# Altium schematic sheet 但总画的.SchDoc
size D
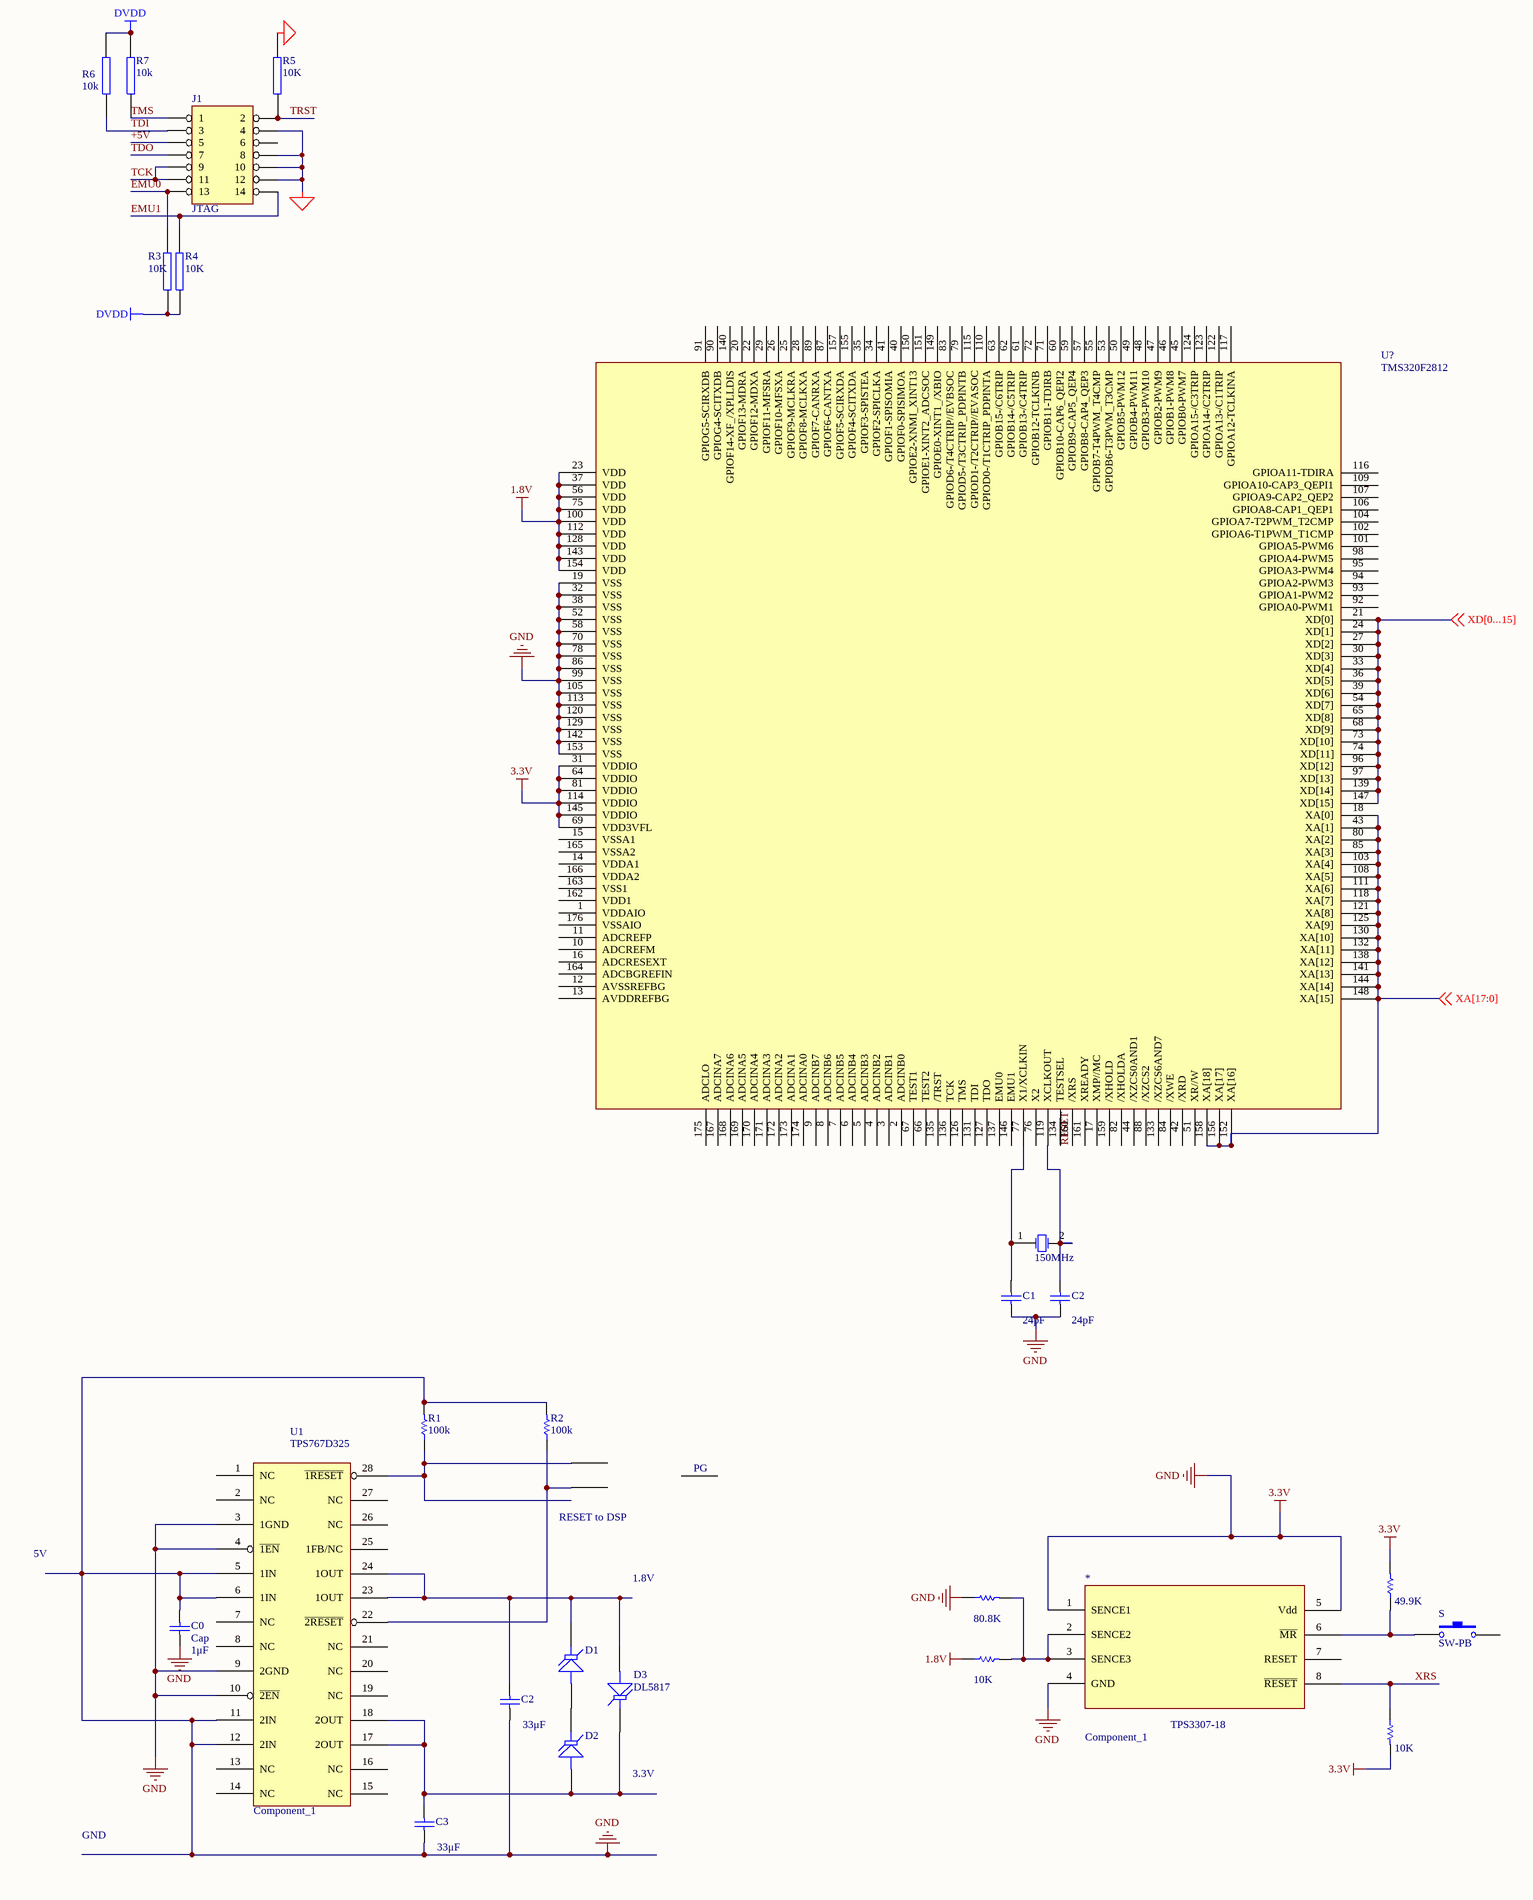
[diagram p0: 但总画的.SchDoc, bottom left]
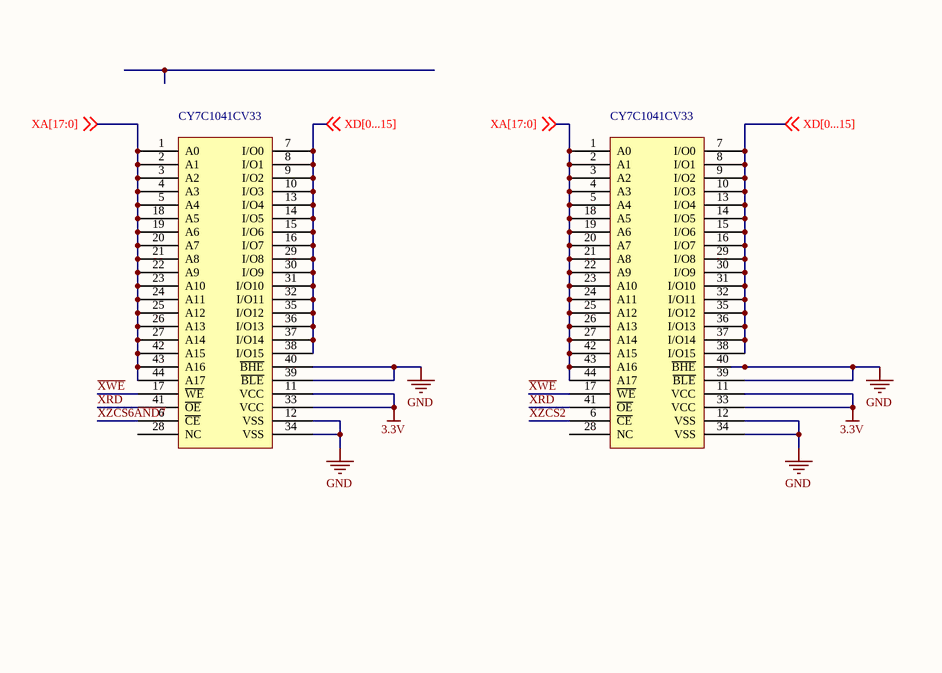
[diagram p1: 但总画的.SchDoc, bottom right]

## Parts
(Parts that share a designator on the sheet are numbered #1, #2 ... from top to bottom, then left to right.)
*#1  (no value)
*#2  Component_1
?  Component_1
C0  Cap  value 1μF  [RAD-0.3]
C1  value 24pF  [RAD-0.3]
C2#1  value 24pF  [RAD-0.3]  (hidden comment: Cap)
C2#2  value 33μF  [RAD-0.3]
C3  value 33μF  [RAD-0.3]
D1  Tranzorb  [DO-7]  (value not drawn)
D2  Tranzorb  [DO-7]  (value not drawn)
D3  DL5817  [DO-7]
J1  JTAG  [IDC-14]
R1  100k  [AXIAL-0.3]
R2  100k  [AXIAL-0.3]
R3  10K  [0805]
R4  10K  [0805]
R5  10K  [0805]
R6  10k  [0805]
R7  10k  [0805]
R?#1  value 80.8K  [AXIAL-0.3]  (hidden comment: Res1)
R?#2  value 49.9K  [AXIAL-0.3]  (hidden comment: Res1)
R?#3  value 10K  [AXIAL-0.3]  (hidden comment: Res1)
R?#4  value 10K  [AXIAL-0.3]  (hidden comment: Res1)
S  SW-PB  [SPST-2]
U?  TMS320F2812  [LQFP-176]
Y?  150MHz  [R38]
  (no value)
  (no value)

## Nets
1.8V: R?#3.1 U?.23(VDD) U?.37(VDD) U?.56(VDD) U?.75(VDD) U?.100(VDD) U?.112(VDD) U?.128(VDD) U?.143(VDD) U?.154(VDD)
3.3V: *#2.1(SENCE1) *#2.4(GND) *#2.5(Vdd) ?.3(1GND) ?.4(~{1EN}) ?.5(1IN) ?.6(1IN) ?.9(2GND) ?.10(~{2EN}) ?.11(2IN) ?.12(2IN) C0.1 C0.2 C1.1 C2#1.1 C2#2.1 C3.1 J1.4 J1.8 J1.10 J1.12 R1.2 R2.2 R5.2 R?#1.1 R?#2.2 R?#4.2 U?.19(VSS) U?.31(VDDIO) U?.32(VSS) U?.38(VSS) U?.52(VSS) U?.58(VSS) U?.64(VDDIO) U?.69(VDD3VFL) U?.70(VSS) U?.78(VSS) U?.81(VDDIO) U?.86(VSS) U?.99(VSS) U?.105(VSS) U?.113(VSS) U?.114(VDDIO) U?.120(VSS) U?.129(VSS) U?.142(VSS) U?.145(VDDIO) U?.153(VSS) .11(VCC) .12(VSS) .33(VCC) .34(VSS) .39(~{BLE}) .40(~{BHE})  [also labelled GND]
DVDD: R3.1 R4.1 R6.2 R7.2
+5V: J1.5
EMU0: J1.13 R3.2
EMU1: J1.14 R4.2
~{RESE}T: U?.160(/XRS)
TCK: J1.9 J1.11
TDI: J1.3 R6.1
TDO: J1.7
TMS: J1.1 R7.1
TRST: J1.2 R5.1
~{XRD}: .41(~{OE})
~{XWE}: .17(~{WE})
~{XZCS2}: .6(~{CE})
~{XZCS6AND7}: .6(~{CE})
XA[17:0]: U?.18(XA[0]) U?.43(XA[1]) U?.80(XA[2]) U?.85(XA[3]) U?.103(XA[4]) U?.108(XA[5]) U?.111(XA[6]) U?.118(XA[7]) U?.121(XA[8]) U?.125(XA[9]) U?.130(XA[10]) U?.132(XA[11]) U?.138(XA[12]) U?.141(XA[13]) U?.144(XA[14]) U?.148(XA[15]) U?.152(XA[16]) U?.156(XA[17]) U?.158(XA[18]) .1(A0) .2(A1) .3(A2) .4(A3) .5(A4) .18(A5) .19(A6) .20(A7) .21(A8) .22(A9) .23(A10) .24(A11) .25(A12) .26(A13) .27(A14) .42(A15) .43(A16) .44(A17) ; off-sheet XA[17:0]
XD[0...15]: U?.21(XD[0]) U?.24(XD[1]) U?.27(XD[2]) U?.30(XD[3]) U?.33(XD[4]) U?.36(XD[5]) U?.39(XD[6]) U?.54(XD[7]) U?.65(XD[8]) U?.68(XD[9]) U?.73(XD[10]) U?.74(XD[11]) U?.96(XD[12]) U?.97(XD[13]) U?.139(XD[14]) U?.147(XD[15]) .7(I/O0) .8(I/O1) .9(I/O2) .10(I/O3) .13(I/O4) .14(I/O5) .15(I/O6) .16(I/O7) .29(I/O8) .30(I/O9) .31(I/O10) .32(I/O11) .35(I/O12) .36(I/O13) .37(I/O14) .38(I/O15) ; off-sheet XD[0...15]
XRS: *#2.8(~{RESET}) R?#4.1
Net*#1_29: *#1.29 ?.28(~{1RESET}) R1.1
Net*#1_30: *#1.30 ?.22(~{2RESET}) R2.1
Net*#2_2: *#2.2(SENCE2) *#2.3(SENCE3) R?#1.2 R?#3.2
Net*#2_6: *#2.6(~{MR}) R?#2.1 S.1
Net?_17: ?.17(2OUT) ?.18(2OUT) C3.2 D2.1(A) D3.2(K)
Net?_23: ?.23(1OUT) ?.24(1OUT) C2#2.2 D1.2(K) D3.1(A)
NetC1_2: C1.2 U?.77(X1/XCLKIN) Y?.1(OSC1)
NetC2#1_2: C2#1.2 U?.119(XCLKOUT) Y?.2(OSC2)
NetD1_1: D1.1(A) D2.2(K)

Not connected (* = marked no-connect by the designer): *#1 31; *#2 7(RESET); ? 1(NC) 2(NC) 7(NC) 8(NC) 13(NC) 14(NC) 15(NC) 16(NC) 19(NC) 20(NC) 21(NC) 25(1FB/NC) 26(NC) 27(NC); J1 6; S 2; U? 1(VDDAIO) 2(ADCINB0) 3(ADCINB1) 4(ADCINB2) 5(ADCINB3) 6(ADCINB4) 7(ADCINB5) 8(ADCINB6) 9(ADCINB7) 10(ADCREFM) 11(ADCREFP) 12(AVSSREFBG) 13(AVDDREFBG) 14(VDDA1) 15(VSSA1) 16(ADCRESEXT) 17(XMP//MC) 20(GPIOF13-MDRA) 22(GPIOF12-MDXA) 25(GPIOF9-MCLKRA) 26(GPIOF10-MFSXA) 28(GPIOF8-MCLKXA) 29(GPIOF11-MFSRA) 34(GPIOF2-SPICLKA) 35(GPIOF3-SPISTEA) 40(GPIOF0-SPISIMOA) 41(GPIOF1-SPISOMIA) 42(/XRD) 44(/XZCS0AND1) 45(GPIOB0-PWM7) 46(GPIOB1-PWM8) 47(GPIOB2-PWM9) 48(GPIOB3-PWM10) 49(GPIOB4-PWM11) 50(GPIOB5-PWM12) 51(XR//W) 53(GPIOB6-T3PWM_T3CMP) 55(GPIOB7-T4PWM_T4CMP) 57(GPIOB8-CAP4_QEP3) 59(GPIOB9-CAP5_QEP4) 60(GPIOB10-CAP6_QEPI2) 61(GPIOB13-/C4TRIP) 62(GPIOB14-/C5TRIP) 63(GPIOB15-/C6TRIP) 66(TEST2) 67(TEST1) 71(GPIOB11-TDIRB) 72(GPIOB12-TCLKINB) 76(X2) 79(GPIOD5-/T3CTRIP_PDPINTB) 82(/XHOLDA) 83(GPIOD6-/T4CTRIP//EVBSOC) 84(/XWE) 87(GPIOF6-CANTXA) 88(/XZCS2) 89(GPIOF7-CANRXA) 90(GPIOG4-SCITXDB) 91(GPIOG5-SCIRXDB) 92(GPIOA0-PWM1) 93(GPIOA1-PWM2) 94(GPIOA2-PWM3) 95(GPIOA3-PWM4) 98(GPIOA4-PWM5) 101(GPIOA5-PWM6) 102(GPIOA6-T1PWM_T1CMP) 104(GPIOA7-T2PWM_T2CMP) 106(GPIOA8-CAP1_QEP1) 107(GPIOA9-CAP2_QEP2) 109(GPIOA10-CAP3_QEPI1) 110(GPIOD0-/T1CTRIP_PDPINTA) 115(GPIOD1-/T2CTRIP//EVASOC) 116(GPIOA11-TDIRA) 117(GPIOA12-TCLKINA) 122(GPIOA13-/C1TRIP) 123(GPIOA14-/C2TRIP) 124(GPIOA15-/C3TRIP) 126(TMS) 127(TDO) 131(TDI) 133(/XZCS6AND7) 134(TESTSEL) 135(/TRST) 136(TCK) 137(EMU0) 140(GPIOF14-XF_/XPLLDIS) 146(EMU1) 149(GPIOE0-XINT1_/XBIO) 150(GPIOE2-XNMI_XINT13) 151(GPIOE1-XINT2_ADCSOC) 155(GPIOF4-SCITXDA) 157(GPIOF5-SCIRXDA) 159(/XHOLD) 161(XREADY) 162(VDD1) 163(VSS1) 164(ADCBGREFIN) 165(VSSA2) 166(VDDA2) 167(ADCINA7) 168(ADCINA6) 169(ADCINA5) 170(ADCINA4) 171(ADCINA3) 172(ADCINA2) 173(ADCINA1) 174(ADCINA0) 175(ADCLO) 176(VSSAIO);  28(NC) 28(NC)

## Notes on the sheet
- (near *#1) PG
- (near *#1) RESET to DSP
- 5V
- 1.8V
- 3.3V
- GND
- (in symbol Component_1) U1; TPS767D325; TPS3307-18; CY7C1041CV33

## Library data of the parts
*#1   = Component_1
C0 C1 C2#1 C2#2 C3 = Cap: Capacitor; Published: 8-Jun-2000; LatestRevisionDate: 17-Jul-2002; LatestRevisionNote: Re-released for DXP Platform.; PackageReference: RAD-0.3; Publisher: Altium Limited; PackageDescription: Radial Cap, Thru-Hole; 2 Leads; 0.3 in Pin Spacing
D1-D3 = Tranzorb: Transient Voltage Suppression (TVS) Diode; Published: 24-Mar-1999; LatestRevisionDate: 17-Jul-2002; LatestRevisionNote: Re-released for DXP Platform.; PackageReference: DO-7; Publisher: Altium Limited; PackageDescription: Axial Lead Diode
J1 = HEADER 7X2
R1 R2 R?#1-R?#4 = Res1: Resistor; Published: 8-Jun-2000; LatestRevisionDate: 17-Jul-2002; LatestRevisionNote: Re-released for DXP Platform.; PackageReference: AXIAL-0.3; Publisher: Altium Limited; PackageDescription: Axial Device, Thru-Hole; 2 Leads; 0.3 in Pin Spacing
R3-R7 = RES2
S = SW-PB: Switch; Published: 24-Mar-1999; LatestRevisionDate: 17-Jul-2002; LatestRevisionNote: Re-released for DXP Platform.; PackageReference: SPST-2; Publisher: Altium Limited; PackageDescription: Switch; 2 Leads
Y? = XTAL: Crystal Oscillator; Published: 8-Jun-2000; LatestRevisionDate: 17-Jul-2002; LatestRevisionNote: Re-released for DXP Platform.; PackageReference: R38; Publisher: Altium Limited; PackageDescription: Crystal, Thru-Hole; 2 Leads; Body 3.1 x 8.2 mm (Dia.xH)